# EAGLE board Baboi_v1.1 (EAGLE 6.4)
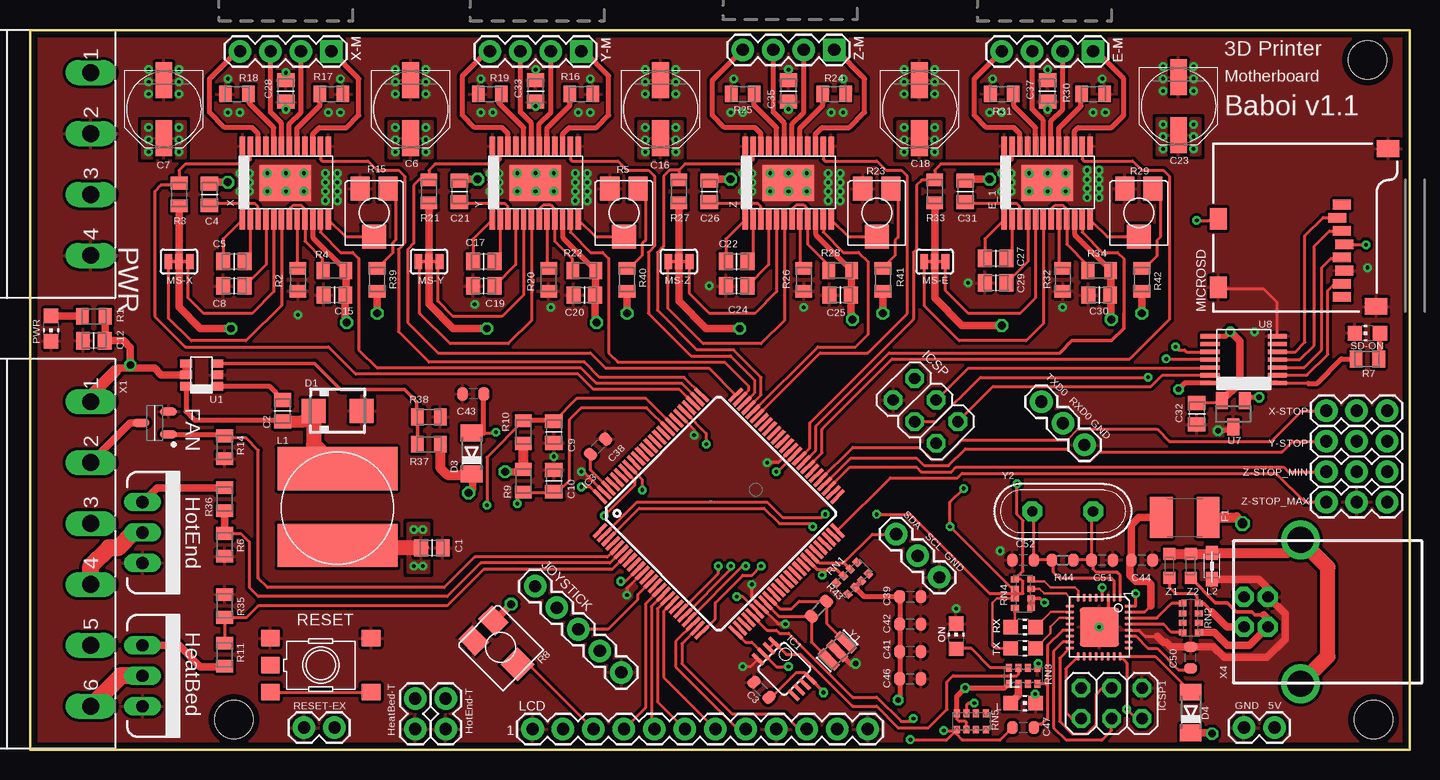
[diagram p2: board, top side]
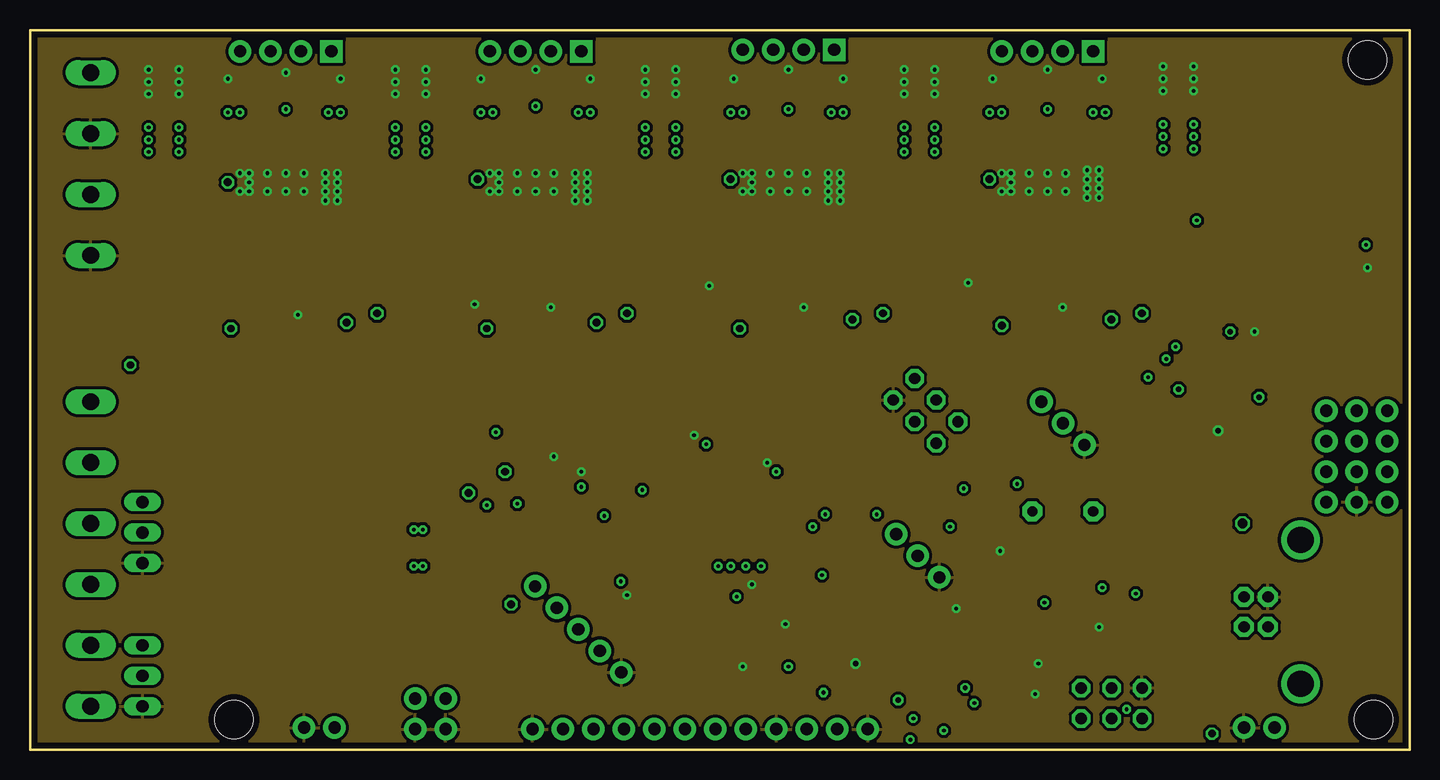
[diagram p3: board, inner layer GND]
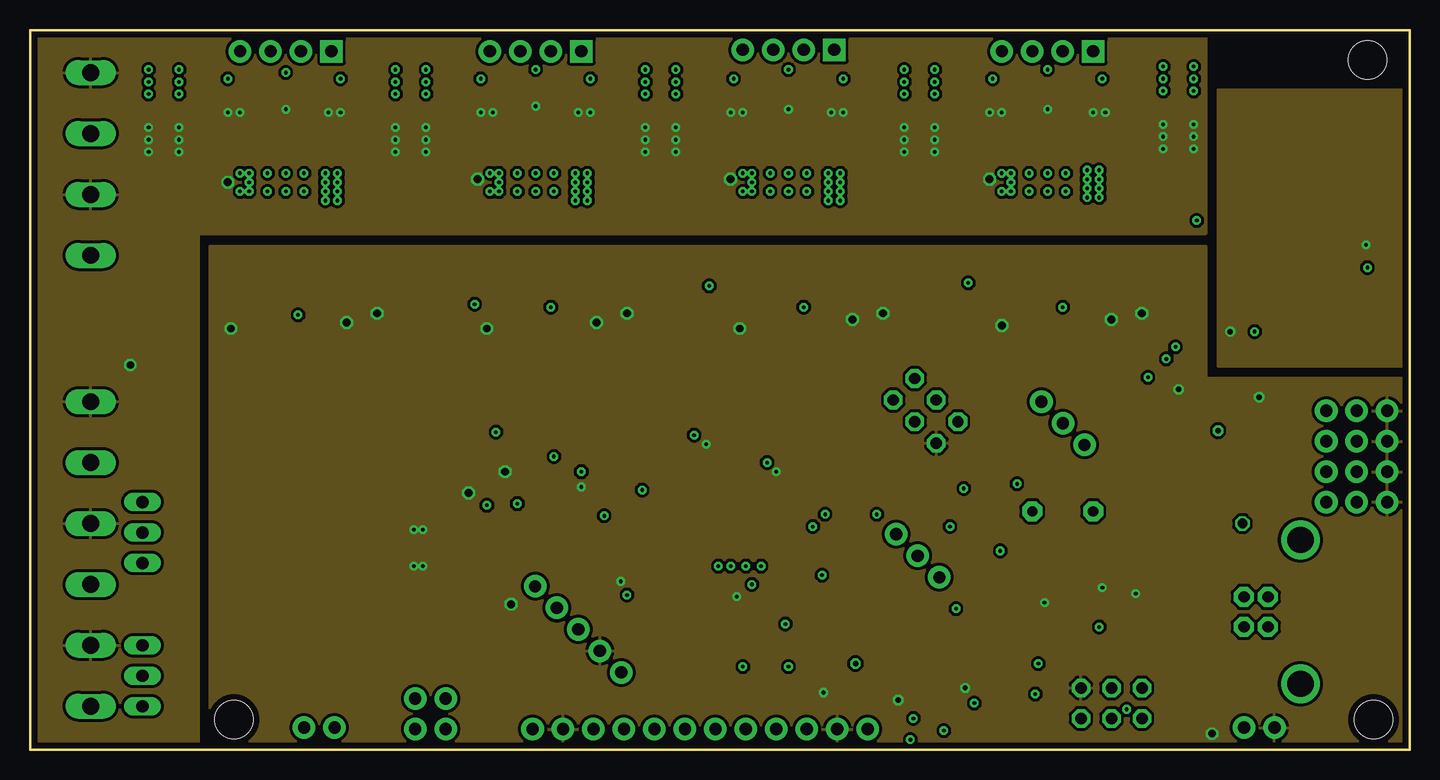
[diagram p4: board, inner layer PWR]
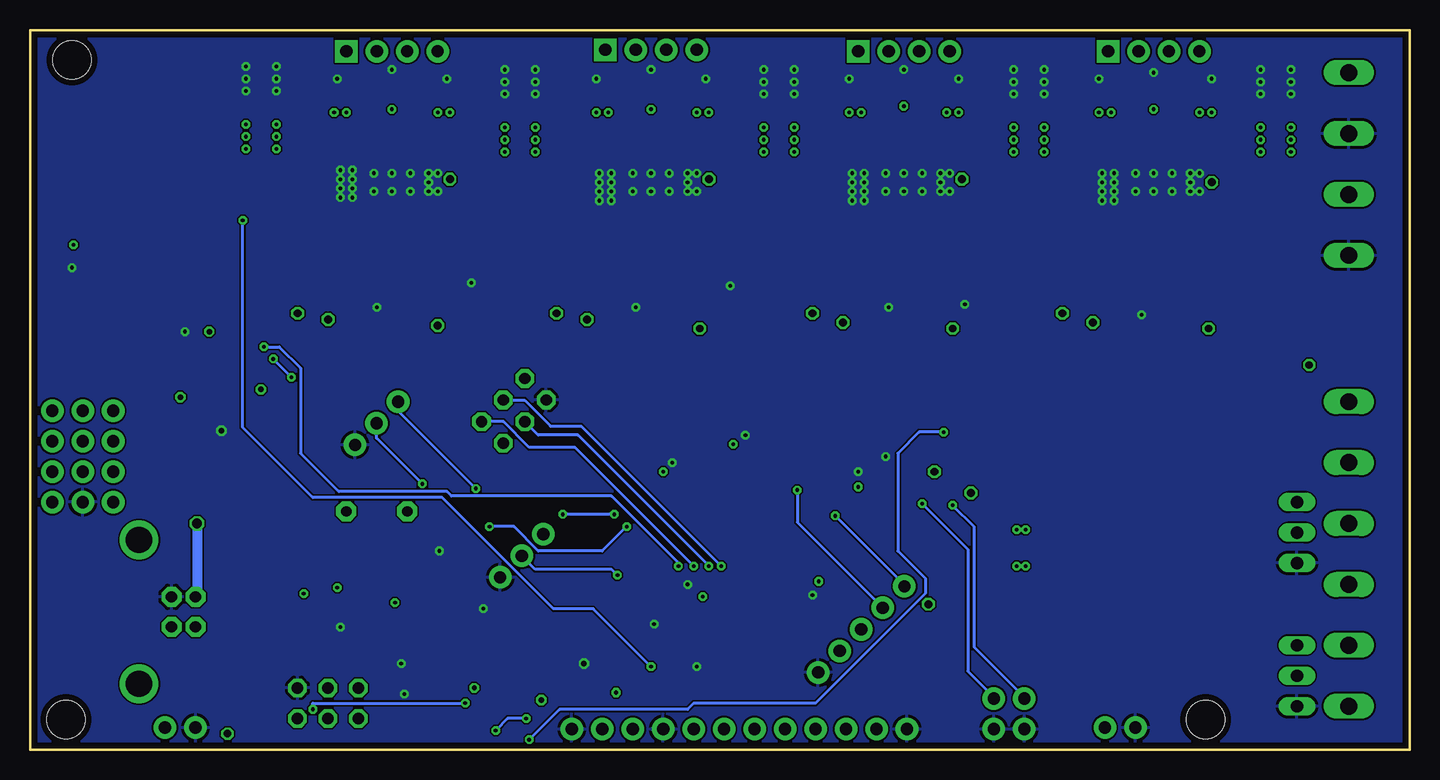
[diagram p5: board, bottom side, seen from below]

Size 115 x 60 mm. Coordinates in mm from the lower left corner, seen from the top.
Outline: 0,0 115,0 115,60 0,60 0,0
Copper layers (1*2+3*16): Top 0.035mm / dielectric 0.6mm / GND 0.035mm / dielectric 0.2mm / PWR 0.035mm / dielectric 0.6mm / Bottom 0.035mm
Design rules "default": minimum track width 6mil, minimum drill 12mil, track to track 6mil, track to pad 7mil, pad to pad 6mil, via to via 6mil, smd to smd 0mil, copper to edge 20mil, drill to drill 10mil, minimum pad ring 10mil, minimum via ring 8mil, stop-mask expansion 6mil, vias tented up to drill 100mil, thermal gap 10mil
Net classes: 2 gnd: width 0.305 mm, drill 0.406 mm, clearance 0.203 mm; 3 power usb: width 0.508 mm, drill 0.406 mm, clearance 0.203 mm
Holes 3.2 mm at 112,2.5 111.5,57.5 17,2.5

## Footprints (pad centres in the part's own frame; a part is rotated, then mirrored left to right if it is on the bottom)
1X02 = drill 1.016 pad 1.88: 1 0,0; 2 2.54,0
CAPC2012X145AN = smd 1.15 x 1.45: 1 -0.9,0; 2 0.9,0
SMARTPRJ_C0603-ROUND = smd 0.898 x 1.1: 1 -0.889,0; 2 0.889,0
PANASONIC_D = smd 3 x 1.4: + 2.4,0; - -2.4,0
C0603-ROUND = smd 0.898 x 1.1: 1 -0.889,0; 2 0.889,0
SMA = smd 2 x 2: A 2,0; C -2,0
MINIMELF = smd 1.4 x 1.8: A 1.7,0; C -1.7,0
1X04 = drill 1.016 pad 1.88 square: 1 0,0 | drill 1.016 pad 1.88: 2 2.54,0; 3 5.08,0; 4 7.62,0
TSSOP-24 = smd 0.45 x 1.65: 1 -3.6,-3.1; 2 -2.95,-3.1; 3 -2.3,-3.1; 4 -1.65,-3.1; 5 -1,-3.1; 6 -0.35,-3.1; 7 0.3,-3.1; 8 0.95,-3.1; 9 1.6,-3.1; 10 2.25,-3.1; 11 2.9,-3.1; 12 3.55,-3.1; 13 3.55,3; 14 2.9,3; 15 2.25,3; 16 1.6,3; 17 0.95,3; 18 0.3,3; 19 -0.35,3; 20 -1,3; 21 -1.65,3; 22 -2.3,3; 23 -2.95,3; 24 -3.6,3 | smd 4.32 x 3: PAD -0.025,-0.05
L1812 = smd 1.9 x 3.4: 1 -1.95,0; 2 1.95,0
SOT95P280X135-3N = smd 1.4 x 0.65: 1 -1.15,0.95; 2 -1.15,-0.95; 3 1.15,0
TO220V = drill 1.016 long: 1 -2.54,0; 2 0,0; 3 2.54,0
LINEAR_MSOP08 = smd 0.3 x 1.2: 1 -0.976,-2.113; 2 -0.326,-2.113; 3 0.324,-2.113; 4 0.974,-2.113; 5 0.974,2.112; 6 0.324,2.112; 7 -0.326,2.112; 8 -0.976,2.112
TQFP100 = smd 1.5 x 0.3: 1 -8,6; 2 -8,5.5; 3 -8,5; 4 -8,4.5; 5 -8,4; 6 -8,3.5; 7 -8,3; 8 -8,2.5; 9 -8,2; 10 -8,1.5; 11 -8,1; 12 -8,0.5; 13 -8,0; 14 -8,-0.5; 15 -8,-1; 16 -8,-1.5; 17 -8,-2; 18 -8,-2.5; 19 -8,-3; 20 -8,-3.5; 21 -8,-4; 22 -8,-4.5; 23 -8,-5; 24 -8,-5.5; 25 -8,-6; 51 8,-6; 52 8,-5.5; 53 8,-5; 54 8,-4.5; 55 8,-4; 56 8,-3.5; 57 8,-3; 58 8,-2.5; 59 8,-2; 60 8,-1.5; 61 8,-1; 62 8,-0.5; 63 8,0; 64 8,0.5; 65 8,1; 66 8,1.5; 67 8,2; 68 8,2.5; 69 8,3; 70 8,3.5; 71 8,4; 72 8,4.5; 73 8,5; 74 8,5.5; 75 8,6 | smd 0.3 x 1.5: 26 -6,-8; 27 -5.5,-8; 28 -5,-8; 29 -4.5,-8; 30 -4,-8; 31 -3.5,-8; 32 -3,-8; 33 -2.5,-8; 34 -2,-8; 35 -1.5,-8; 36 -1,-8; 37 -0.5,-8; 38 0,-8; 39 0.5,-8; 40 1,-8; 41 1.5,-8; 42 2,-8; 43 2.5,-8; 44 3,-8; 45 3.5,-8; 46 4,-8; 47 4.5,-8; 48 5,-8; 49 5.5,-8; 50 6,-8; 76 6,8; 77 5.5,8; 78 5,8; 79 4.5,8; 80 4,8; 81 3.5,8; 82 3,8; 83 2.5,8; 84 2,8; 85 1.5,8; 86 1,8; 87 0.5,8; 88 0,8; 89 -0.5,8; 90 -1,8; 91 -1.5,8; 92 -2,8; 93 -2.5,8; 94 -3,8; 95 -3.5,8; 96 -4,8; 97 -4.5,8; 98 -5,8; 99 -5.5,8; 100 -6,8
MLF32 = smd 0.7 x 0.28: 1 -2.45,1.75; 2 -2.45,1.25; 3 -2.45,0.75; 4 -2.45,0.25; 5 -2.45,-0.25; 6 -2.45,-0.75; 7 -2.45,-1.25; 8 -2.45,-1.75; 17 2.45,-1.75; 18 2.45,-1.25; 19 2.45,-0.75; 20 2.45,-0.25; 21 2.45,0.25; 22 2.45,0.75; 23 2.45,1.25; 24 2.45,1.75 | smd 0.28 x 0.7: 9 -1.75,-2.45; 10 -1.25,-2.45; 11 -0.75,-2.45; 12 -0.25,-2.45; 13 0.25,-2.45; 14 0.75,-2.45; 15 1.25,-2.45; 16 1.75,-2.45; 25 1.75,2.45; 26 1.25,2.45; 27 0.75,2.45; 28 0.25,2.45; 29 -0.25,2.45; 30 -0.75,2.45; 31 -1.25,2.45; 32 -1.75,2.45 | smd 3.254 x 3.254: 33 0,0
2X03 = drill 0.95 pad 1.55 octagon: 1 -2.54,-1.27; 2 -2.54,1.27; 3 0,-1.27; 4 0,1.27; 5 2.54,-1.27; 6 2.54,1.27
1X05 = drill 1.016 pad 1.88: 1 0,0; 2 2.54,0; 3 5.08,0; 4 7.62,0; 5 10.16,0
CHIP-LED0805 = smd 1.2 x 1.2: A 0,-1.05; C 0,1.05
SDR1006 = smd 10.008 x 3.607: P$1 0,3.048; P$2 0,-3.353
0805 = smd 1.2 x 1: 1 -1.1,0; 2 1.1,0
1X12 = drill 1.016 pad 1.88: 1 0,0; 2 2.54,0; 3 5.08,0; 4 7.62,0; 5 10.16,0; 6 12.7,0; 7 15.24,0; 8 17.78,0; 9 20.32,0; 10 22.86,0; 11 25.4,0; 12 27.94,0
SJ_3_CONNECTED = smd 0.635 x 1.27: 1 -0.889,0; 2 0,0; 3 0.889,0
MSTBA4 = drill 1.397 long: 1 -7.62,5.08; 2 -2.54,5.08; 3 2.54,5.08; 4 7.62,5.08
RESC2012X70N = smd 1.05 x 1.4: 1 -0.95,0; 2 0.95,0
RTRIM-ST4ETB = smd 1.6 x 2: 1 -1.175,-2; 2 1.175,-2 | smd 2 x 2: W 0,2
R0603-ROUND = smd 0.898 x 1.1: 1 -0.889,0; 2 0.889,0
TS42 = smd 1.6 x 1.4: 1 -4.2,2.25; 2 4.2,2.25; 3 -4.2,-2.25; 4 4.2,-2.25; 5 -4.2,0
RESISTOR-DIL_CAT16 = smd 0.5 x 0.65: 1 -1.2,-0.675; 2 -0.4,-0.675; 3 0.4,-0.675; 4 1.2,-0.675; 5 1.2,0.675; 6 0.4,0.675; 7 -0.4,0.675; 8 -1.2,0.675
CAY16 = smd 0.5 x 0.65: 1 -1.2,-0.675; 2 -0.4,-0.675; 3 0.4,-0.675; 4 1.2,-0.675; 5 1.2,0.675; 6 0.4,0.675; 7 -0.4,0.675; 8 -1.2,0.675
CAT16 = smd 0.5 x 0.65: 1 -1.2,-0.675; 2 -0.4,-0.675; 3 0.4,-0.675; 4 1.2,-0.675; 5 1.2,0.675; 6 0.4,0.675; 7 -0.4,0.675; 8 -1.2,0.675
1X03 = drill 1.016 pad 1.88: 1 0,0; 2 2.54,0; 3 5.08,0
TSOT6 = smd 0.69 x 1: 1 -1,-1.4; 2 -0.05,-1.4; 3 0.9,-1.4; 4 0.9,1.2; 5 -0.05,1.2; 6 -1,1.2
MICRO-SD-SOCKET-PP = smd 0.8 x 1.5: 1 -8.94,10.7; 2 -7.84,10.3; 3 -6.74,10.7; 4 -5.64,10.9; 5 -4.54,10.7; 6 -3.44,10.9; 7 -2.34,10.7; 8 -1.24,10.7 | smd 1.8 x 1.4: CD1 -2.05,0.4; CD2 -7.75,0.4 | smd 1.4 x 1.9: GND1 -13.6,14.55; GND3 -0.45,13.55
SOT23C = smd 1 x 1.4: 1 -0.95,-1.1; 2 0.95,-1.1; 3 0,1.1
TSSOP14 = smd 0.35 x 1.6: 1 -2,-2.9; 2 -1.35,-2.9; 3 -0.7,-2.9; 4 -0.05,-2.9; 5 0.6,-2.9; 6 1.25,-2.9; 7 1.9,-2.9; 8 1.9,2.7; 9 1.25,2.7; 10 0.6,2.7; 11 -0.05,2.7; 12 -0.7,2.7; 13 -1.35,2.7; 14 -2,2.7
MSTBA6 = drill 1.397 long: 1 -12.7,5.08; 2 -7.62,5.08; 3 -2.54,5.08; 4 2.54,5.08; 5 7.62,5.08; 6 12.7,5.08
PN61729 = drill 0.95 pad 1.676 octagon: 1 1.25,4.71; 2 -1.25,4.71; 3 -1.25,2.71; 4 1.25,2.71 | drill 2.2: P$1 -6,0; P$2 6,0
RESONATOR = smd 0.7 x 2: 1 -1,0; 2 0,0; 3 1,0
QS = drill 0.85 pad 1.676 octagon: 1 -2.54,0; 2 2.54,0
CT/CN0603 = smd 1 x 1: 1 -1,0; 2 1,0

## Placement (x,y rotation side)
5V  [1X02]  101.2,1.83 0 top
B-T  [1X02]  34.66,1.7 90 top
C1  22uF  [CAPC2012X145AN]  33.51,16.82 0 top
C2  0.22uF  [CAPC2012X145AN]  21.07,28.25 90 top
C3  100n  [SMARTPRJ_C0603-ROUND]  60.97,4.99 135 top
C4  0.1uF  [CAPC2012X145AN]  14.97,46.28 270 top
C5  0.1uF  [CAPC2012X145AN]  17,40.69 180 top
C6  100uF  [PANASONIC_D]  31.73,53.39 270 top
C7  100uF  [PANASONIC_D]  11.16,53.39 270 top
C8  0.22uF  [CAPC2012X145AN]  17,38.66 0 top
C9  10uF  [CAPC2012X145AN]  43.67,26.47 90 top
C10  10uF  [CAPC2012X145AN]  43.67,22.4 270 top
C12  1uF  [CAPC2012X145AN]  5.32,34.09 180 top
C15  10uF  [CAPC2012X145AN]  25.38,37.9 0 top
C16  100uF  [PANASONIC_D]  52.56,53.39 270 top
C17  0.1uF  [CAPC2012X145AN]  37.83,40.69 180 top
C18  100uF  [PANASONIC_D]  74.15,53.39 270 top
C19  0.22uF  [CAPC2012X145AN]  37.83,38.66 0 top
C20  10uF  [CAPC2012X145AN]  46.21,37.9 0 top
C21  0.1uF  [CAPC2012X145AN]  35.8,46.53 270 top
C22  0.1uF  [CAPC2012X145AN]  58.91,40.69 180 top
C23  100uF  [PANASONIC_D]  95.74,53.65 270 top
C24  0.22uF  [CAPC2012X145AN]  58.91,38.66 0 top
C25  10uF  [CAPC2012X145AN]  67.55,37.9 0 top
C26  0.1uF  [CAPC2012X145AN]  56.63,46.53 270 top
C27  0.1uF  [CAPC2012X145AN]  80.5,40.95 180 top
C28  0.1uF  [CAPC2012X145AN]  21.32,54.92 90 top
C29  0.22uF  [CAPC2012X145AN]  80.5,38.91 0 top
C30  10uF  [CAPC2012X145AN]  89.14,37.9 0 top
C31  0.1uF  [CAPC2012X145AN]  77.96,46.53 270 top
C32  10uF  [CAPC2012X145AN]  97.27,27.99 270 top
C33  0.1uF  [CAPC2012X145AN]  42.15,54.92 90 top
C35  0.1uF  [CAPC2012X145AN]  63.23,54.92 90 top
C37  0.1uF  [CAPC2012X145AN]  84.82,54.92 90 top
C38  100n  [C0603-ROUND]  47.36,25.26 45 top
C39  100n  [C0603-ROUND]  73.39,12.75 0 top
C41  100n  [C0603-ROUND]  73.39,8.18 0 top
C42  100n  [C0603-ROUND]  73.39,10.47 0 top
C43  22p  [C0603-ROUND]  36.94,29.64 180 top
C44  100n  [C0603-ROUND]  92.69,15.8 0 top
C46  100n  [C0603-ROUND]  73.39,5.89 0 top
C47  100n  [C0603-ROUND]  82.79,1.83 180 top
C50  1u  [C0603-ROUND]  96.76,7.67 90 top
C51  22p  [C0603-ROUND]  89.39,15.8 0 top
C52  22p  [C0603-ROUND]  82.79,15.8 180 top
D1  [SMA]  25.64,28.25 0 top
D3  CD1206-S01575  [MINIMELF]  36.81,24.69 90 top
D4  CD1206-S01575  [MINIMELF]  96.76,3.1 90 top
E-M  [1X04]  88.63,58.22 180 top
E_1  A4982  [TSSOP-24]  84.82,47.3 0 top
F1  MF-MSMF050-2 500mA  [L1812]  96.25,19.36 0 top
FAN  RFP30N06LE  [SOT95P280X135-3N]  10.4,27.23 180 top
HEATBED  RFP30N06LE  [TO220V]  9.38,6.15 270 top
HOT-T  [1X02]  32.11,1.7 90 top
HOTEND  RFP30N06LE  [TO220V]  9.38,18.09 270 top
IC1  LINEAR_LMV358MMX  [LINEAR_MSOP08]  62.87,6.72 225 top
IC3  ATMEGA2560-16AU  [TQFP100]  57.42,19.67 45 top
IC4  ATMEGA16U2-MU  [MLF32]  89.14,10.21 270 top
ICSP  3x2M  [2X03]  74.66,28.25 135 top
ICSP1  3x2M  [2X03]  90.15,3.86 0 top
JOYSTICK  [1X05]  49.3,6.43 135 top
L  YELLOW  [CHIP-LED0805]  82.79,3.86 270 top
L1  47uH  [SDR1006]  25.64,20.37 0 top
L2  BLM21  [0805]  98.54,15.29 90 top
LCD  M12PTH  [1X12]  69.83,1.7 180 top
LED  PWR  [CHIP-LED0805]  1.76,35.1 180 top
MS-E  [SJ_3_CONNECTED]  75.42,40.69 180 top
MS-X  [SJ_3_CONNECTED]  12.43,40.69 180 top
MS-Y  [SJ_3_CONNECTED]  33.26,40.69 180 top
MS-Z  [SJ_3_CONNECTED]  54.09,40.69 180 top
ON  GREEN  [CHIP-LED0805]  77.2,9.45 0 top
PWR  MSTBA4  [MSTBA4]  -0.02,48.82 270 top
R1  3k  [RESC2012X70N]  5.32,36.12 0 top
R2  10k  [RESC2012X70N]  22.34,39.17 270 top
R3  100k  [RESC2012X70N]  12.43,46.28 90 top
R4  100k  [RESC2012X70N]  25.38,39.93 180 top
R5  10k  [RTRIM-ST4ETB]  49.51,44.76 180 top
R6  100k  [RESC2012X70N]  16.24,17.07 270 top
R7  750  [RESC2012X70N]  111.49,32.56 180 top
R8  10k  [RTRIM-ST4ETB]  39.23,8.51 225 top
R9  4.7k  [RESC2012X70N]  41.13,22.4 90 top
R10  4.7k  [RESC2012X70N]  41.13,26.47 270 top
R11  100  [RESC2012X70N]  16.24,7.91 270 top
R14  100k  [RESC2012X70N]  16.24,25.2 270 top
R15  10k  [RTRIM-ST4ETB]  28.69,44.76 180 top
R16  0.1  [RESC2012X70N]  45.96,54.66 0 top
R17  0.11  [RESC2012X70N]  25.13,54.66 0 top
R18  0.11  [RESC2012X70N]  17.26,54.66 180 top
R19  0.1  [RESC2012X70N]  38.34,54.66 180 top
R20  10k  [RESC2012X70N]  43.24,39.17 270 top
R21  100k  [RESC2012X70N]  33.26,46.53 90 top
R22  100k  [RESC2012X70N]  46.21,39.93 180 top
R23  10k  [RTRIM-ST4ETB]  70.6,44.76 180 top
R24  0.1  [RESC2012X70N]  67.04,54.66 0 top
R25  0.1  [RESC2012X70N]  59.42,54.66 180 top
R26  10k  [RESC2012X70N]  64.5,39.17 270 top
R27  100k  [RESC2012X70N]  54.09,46.53 90 top
R28  100k  [RESC2012X70N]  67.55,39.93 180 top
R29  10k  [RTRIM-ST4ETB]  92.44,44.76 180 top
R30  0.1  [RESC2012X70N]  88.63,54.66 0 top
R31  0.1  [RESC2012X70N]  81.01,54.66 180 top
R32  10k  [RESC2012X70N]  86.09,39.17 270 top
R33  100k  [RESC2012X70N]  75.42,46.53 90 top
R34  100k  [RESC2012X70N]  89.14,39.93 180 top
R35  100k  [RESC2012X70N]  16.24,11.97 90 top
R36  100  [RESC2012X70N]  16.24,20.88 90 top
R37  5.6k  [RESC2012X70N]  33.26,25.45 180 top
R38  1k  [RESC2012X70N]  33.26,27.74 0 top
R39  20k  [RESC2012X70N]  28.94,39.17 270 top
R40  20k  [RESC2012X70N]  49.77,39.17 270 top
R41  20k  [RESC2012X70N]  71.1,39.17 270 top
R42  20k  [RESC2012X70N]  92.69,39.17 270 top
R43  1M  [R0603-ROUND]  65.77,11.74 225 top
R44  1M  [R0603-ROUND]  86.09,15.8 180 top
RESET  TS42031-160R-TR-7260  [TS42]  24.24,7.04 0 top
RESET-EX  [1X02]  22.84,1.83 0 top
RN1  10k  [RESISTOR-DIL_CAT16]  68.56,14.28 225 top
RN2  22R  [CAY16]  96.76,10.97 270 top
RN3  1k  [CAY16]  82.79,6.15 0 top
RN4  1k  [CAY16]  82.79,13.01 270 top
RN5  10K  [CAT16]  78.47,2.34 0 top
RX  YELLOW  [CHIP-LED0805]  82.79,10.21 270 top
RXD-TXD  [1X03]  84.31,29 315 top
SD-ON  Red  [CHIP-LED0805]  111.49,34.72 90 top
SDA-SCL  [1X03]  72.21,17.95 315 top
TX  YELLOW  [CHIP-LED0805]  82.79,8.43 270 top
U1  LM2841  [TSOT6]  14.21,31.29 90 top
U2  USD-SOCKETNEW  [MICRO-SD-SOCKET-PP]  98.66,36.5 270 top
U7  AP7313  [SOT23C]  100.31,27.99 180 top
U8  TXB0104  [TSSOP14]  101.08,32.56 90 top
X  A4982  [TSSOP-24]  21.32,47.3 0 top
X1  MSTBA6  [MSTBA6]  -0.02,16.31 270 top
X4  USB-B_TH  [PN61729]  105.9,11.48 90 top
X-M  [1X04]  25.13,58.22 180 top
X-STOP  [1X03]  113.14,28.25 180 top
Y  A4982  [TSSOP-24]  42.15,47.3 0 top
Y1  CSTCE16M0V53-R0 16MHZ  [RESONATOR]  67.29,8.22 45 top
Y2  16MHz  [QS]  86.09,19.86 0 top
Y-M  [1X04]  45.96,58.22 180 top
Y-STOP  [1X03]  113.14,25.71 180 top
Z  A4982  [TSSOP-24]  63.23,47.3 0 top
Z1  CG0603MLC-05E  [CT/CN0603]  94.98,15.29 270 top
Z2  CG0603MLC-05E  [CT/CN0603]  96.76,15.29 270 top
Z-M  [1X04]  67.04,58.34 180 top
Z-STOP_MAX  [1X03]  113.14,20.63 180 top
Z-STOP_MIN  [1X03]  113.14,23.17 180 top

## Tracks (layer width: path | path; a pad name or v marks a point on that pad's centre or on a via)
12V  (via drill 0.3, 0.61, 0.66)
  Top 0.61: C4.1 15.09,47.3 v16.49,47.3 | 35.91,47.55 v37.32,47.55 | C26.1 56.74,47.55 v58.4,47.55 | C31.1 78.08,47.55 v79.99,47.55 | U1.4 U1.5 10.96,31.24 10.4,31.8 8.37,31.8 | 8.37,31.8 7.35,31.8 7.1,31.55 | 8.37,31.8 v8.37,32.06 8.37,33.53 7.81,34.09 C12.1 6.27,34.14 R1.2
  Top 0.813: C21.1 35.91,47.55
  Top 1.016: X1.1 5.06,29.52 7.1,31.55
  other vias: 16.49,53.14 17.51,53.14 21.32,53.39 24.88,53.14 25.89,53.14 9.89,51.87 9.89,50.85 9.89,49.84 12.43,51.87 12.43,50.85 12.43,49.84 37.58,53.14 38.59,53.14 42.15,53.65 45.7,53.14 46.72,53.14 33,51.87 33,50.85 33,49.84 30.46,49.84 30.46,50.85 30.46,51.87 63.23,53.39 58.4,53.14 59.42,53.14 66.79,53.14 67.8,53.14 53.83,51.87 53.83,50.85 53.83,49.84 51.29,49.84 51.29,50.85 51.29,51.87 79.99,53.14 81.01,53.14 88.63,53.14 89.65,53.14 84.82,53.39 75.42,51.87 75.42,50.85 75.42,49.84 72.88,49.84 72.88,50.85 72.88,51.87 97.01,52.12 97.01,51.11 97.01,50.09 94.47,50.09 94.47,51.11 94.47,52.12
  pour Top: 17.51,50.85 24.88,50.85 27.42,52.88 27.42,53.9 14.97,53.9 14.97,53.14
  pour Top: 9.38,52.38 12.94,52.38 12.94,49.33 9.38,49.33
  pour Top: 38.34,50.85 45.96,50.85 48.24,52.88 48.24,53.9 36.05,53.9 36.05,52.88
  pour Top: 29.96,52.38 33.51,52.38 33.51,49.33 29.96,49.33
  pour Top: 59.42,50.85 66.79,50.85 69.58,52.88 69.58,54.41 56.88,54.41 56.88,53.14
  pour Top: 50.78,52.38 54.34,52.38 54.34,49.33 50.78,49.33
  pour Top: 81.01,50.85 88.38,50.85 91.17,52.88 91.17,54.15 78.72,54.15 78.72,52.88
  pour Top: 72.37,52.38 75.93,52.38 75.93,49.33 72.37,49.33
  pour Top: 93.96,52.63 97.52,52.63 97.52,49.58 93.96,49.58
  pour PWR (isolate 0.254, rank 6): 0,60 98,60 98,43 14,43 14,0 0,0
+3V3  (via drill 0.3, 0.46)
  Top 0.254: U2.4 109.61,42.09 v111.36,42.09 | U8.1 106.5,30.56 106.54,30.53 | U7.2 99.16,28.89 C32.1
  Top 0.406: U8.1 100.85,30.56 100.82,30.53 | U8.8 99.67,34.46 v100.06,34.85 | 106.54,30.53 107.3,30.53 109.33,32.56 R7.2
  Top 0.61: 100.85,30.56 100.85,34.06 v100.06,34.85 | U7.2 100.8,30.53 100.82,30.53
  pour PWR (isolate 0.254): 99,32 115,32 115,55 99,55
+5V  (via drill 0.3, 0.36, 0.41, 0.46, 0.61, 0.66)
  Top 0.254: IC4.4 v89.39,13.51 | IC4.32 92.19,11.96 v92.19,13.01 | RN5.8 77.27,2.52 77.45,2.34 77.96,2.34 78.07,2.23 RN5.2 | IC3.100 46.71,21.9 v45.96,21.9 | IC3.80 56.37,26.37 v56.37,25.45 | IC3.61 62.33,23.17 v62.21,23.17 | IC3.31 59.39,12.75 v58.91,12.75 | IC3.10 49.65,14.02 v49.26,14.02 | IC1.8 64.57,6.4 63.87,6.4 61.83,4.36 C3.1
  Top 0.305: RN4.6 84.2,12.61 v84.57,12.24 | IC1.8 arc-3 v66.15,4.75
  Top 0.406: X.10 23.57,42.69 R4.1 | Y.10 44.4,42.69 R22.1 | Z.10 65.48,42.95 R28.1 | E_1.10 87.07,42.95 R34.1 | U8.14 96.28,30.56 v95.74,30.02 | RN5.8 77.27,4.44 v77.96,5.13 81.25,5.13 RN3.1 | v72.37,4.12 72.5,4.24 C46.1 C41.1 C42.1 C39.1 69.52,12.75 RN1.6 RN1.7 | U7.1 101.56,29.39 v102.47,29.39
  Top 0.61: MS-X.2 R3.1 12.43,36.88 14.21,35.1 v16.75,35.1 | v26.4,35.61 26.28,35.73 C15.2 26.33,37.95 R4.1 | R22.1 47.16,37.95 C20.2 47.11,35.73 v47.23,35.61 | R21.1 MS-Y.2 33.26,37.14 35.29,35.1 v38.08,35.1 | R39.2 v28.94,36.37 | R40.2 v49.77,36.37 | R27.1 MS-Z.2 54.09,37.39 56.37,35.1 v59.17,35.1 | R28.1 68.5,37.9 C25.2 68.45,35.87 v68.56,35.87 | R41.2 v71.1,36.37 | R34.1 90.09,37.95 | 90.09,37.95 C30.2 | R33.1 MS-E.2 75.42,37.64 77.71,35.36 v81.01,35.36 | 90.09,37.95 90.09,36.12 | R42.2 v92.69,36.37 | RN4.6 RN4.5 | 36.89,22.91 36.89,21.72 v36.56,21.39 | R9.2 40.94,23.17 v39.61,23.17 | D4.C 98.54,1.4 v98.54,1.32 | 38.72,10.83 38.83,10.83 v40.12,12.12
  Top 0.813: 90.09,36.12 90.09,35.93 v90.15,35.87 | 36.89,22.91 D3.C 36.74,22.91 34.78,22.91 34.21,23.49 R37.1 | R9.2 R10.2 | R8.1 38.72,10.83
  Top 1.27: C1.1 29.19,16.82 29.19,17.07 25.64,17.07 L1.P$2
  other vias: 31.99,18.34 32.75,18.34 31.99,15.29 32.75,15.29
  pour PWR (isolate 0.254): 15,42 98,42 98,31 115,31 115,0 15,0
  pour Top (isolate 0.254): 31.48,18.85 31.48,14.78 33.26,14.78 33.26,18.85
A3  (via drill 0.3)
  Top 0.254: IC3.94 50.4,22.44 50.4,22.02 v47.86,19.48
  Bottom 0.254: v47.86,19.48 42.11,13.73 JOYSTICK.5
A4  (via drill 0.3)
  Top 0.254: IC3.93 51.04,22.51 v51.04,21.64
  Bottom 0.254: v51.04,21.64 51.04,18.95 JOYSTICK.4
A13  (via drill 0.3)
  Top 0.254: IC3.84 51.42,28.5 45.96,28.5 44.94,27.48 44.94,22.4 44.43,21.9 44.06,21.9 C10.2 43.62,21.45 R9.1 40.62,20.95 v40.62,20.5
  Bottom 0.254: v40.62,20.5 36.81,16.69 36.81,6.53 34.66,4.37 B-T.2
A14  (via drill 0.3)
  Top 0.254: IC3.83 51.36,29.26 45.57,29.26 C9.2 | R10.1 38.08,24.37 v38.08,20.37
  Top 0.406: C9.2 43.62,27.42 R10.1
  Bottom 0.254: v38.08,20.37 36.31,18.59 36.31,8.56 32.11,4.37 HOT-T.2
AREF
  Top 0.254: IC3.98 46.72,23.3 C38.1 | C38.1 | C38.1 46.72,24.69
D2
  Top 0.254: IC3.6 48.34,15.55 37.58,15.55 34.78,12.75 19.03,12.75 18.27,13.51 18.27,17.32 17.58,18.02 R6.1
  Top 0.61: R36.1 R6.1
D3
  Top 0.254: R11.1 R35.1 18.07,11.02 19.03,11.99 34.78,11.99 37.83,15.04 48.54,15.04 IC3.7
D5
  Top 0.254: IC3.5 48.14,16.05 37.07,16.05 34.53,13.51 19.8,13.51 19.03,14.28 19.03,24.94 18.02,25.96 16.43,25.96 R14.1
  Top 0.406: FAN.1 16.24,26.28 R14.1
D6
  Top 0.254: IC3.15 51.29,12.13 51.29,3.48 LCD.9
D7
  Top 0.254: IC3.16 51.8,11.93 51.8,1.96 LCD.8
D8
  Top 0.254: IC3.17 52.31,11.73 52.31,3.99 LCD.7
D9
  Top 0.254: IC3.18 52.82,11.54 52.82,6.02 LCD.6
D10
  Top 0.254: IC3.23 53.83,9.02 53.83,6.91 59.04,1.7 LCD.5
D11
  Top 0.254: IC3.24 54.34,8.82 54.34,7.16 58.53,2.97 62.85,2.97 64.12,1.7 LCD.3
D12  (via drill 0.3)
  Top 0.254: IC3.25 57.13,10.9 57.13,12.24 59.42,14.53 60.18,14.53 v60.94,15.29 | v95.49,33.58 95.74,33.33 96.25,33.33 96.41,33.16 U8.10
  Bottom 0.254: v60.94,15.29 60.94,15.55 66.53,21.13 79.87,21.13 80.25,21.52 89.27,21.52 92.44,24.69 92.44,31.8 94.22,33.58 v95.49,33.58
D13  (via drill 0.3)
  Top 0.254: v63.23,6.91 62.21,6.91 IC1.3 60.18,8.94 59.66,8.94 IC3.26 | v97.27,44.12 98.93,44.12 U2.CD2
  Bottom 0.254: v63.23,6.91 68.06,11.74 71.36,11.74 80.63,21.01 91.42,21.01 97.27,26.85 v97.27,44.12
D16
  Top 0.254: IC3.13 50.66,12.91 50.66,12.5 48.18,10.02 JOYSTICK.3
D22
  Top 0.254: X.23 18.37,49.17 18.02,48.82 12.94,48.82 12.43,48.31 R3.2 12.43,47.04 10.91,47.04 10.4,46.53 10.4,36.12 12.94,33.58 24.88,33.58 27.16,31.29 45.7,31.29 46.97,30.02 54.13,30.02 IC3.78
D23
  Top 0.254: X.11 24.22,43.13 25.89,41.45 26.91,41.45 27.42,40.95 27.42,33.33 28.94,31.8 45.96,31.8 47.23,30.53 54.33,30.53 IC3.77
D24
  Top 0.254: X.14 24.22,49.22 24.37,49.07 28.18,49.07 28.94,48.31 30.72,48.31 31.23,47.8 31.23,42.22 30.72,41.71 30.72,34.85 33,32.56 33.26,32.31 46.21,32.31 47.48,31.04 54.53,31.04 IC3.76
D25
  Top 0.254: Y.23 39.2,49.17 38.85,48.82 33.77,48.82 33.26,48.31 R21.2 33.26,47.3 33,47.55 32.5,47.55 31.99,47.04 31.99,42.22 31.48,41.71 31.48,35.61 34.02,33.07 46.72,33.07 47.99,31.8 56.6,31.8 IC3.75
D26
  Top 0.254: Y.11 45.05,43.13 46.72,41.45 47.74,41.45 48.24,40.95 48.24,33.07 49.01,32.31 57.9,32.31 59.93,30.28 59.93,29.96 IC3.74
D27
  Top 0.254: Y.14 45.05,49.22 45.2,49.07 49.01,49.07 49.77,48.31 51.55,48.31 52.05,47.8 52.05,41.96 51.55,41.45 51.55,36.37 55.1,32.82 58.4,32.82 60.44,30.79 60.44,29.76 IC3.73
D28
  Top 0.254: Z.23 60.28,49.17 59.93,48.82 54.59,48.82 54.09,48.31 | 54.09,48.31 R27.2 | 54.09,48.31 53.32,48.31 52.82,47.8 52.82,41.96 52.31,41.45 52.31,36.63 55.61,33.33 58.66,33.33 60.94,31.04 60.94,29.56 IC3.72
D29
  Top 0.254: Z.11 66.13,43.13 67.8,41.45 69.07,41.45 69.83,40.69 69.83,34.6 68.82,33.58 65.67,33.58 IC3.71
D30
  Top 0.254: E_1.23 81.87,49.17 81.52,48.82 75.93,48.82 75.42,48.31 R33.2 74.34,47.48 73.9,47.04 73.9,41.71 73.64,41.45 73.64,35.87 65.01,27.23 65.01,25.14 IC3.60
D31
  Top 0.254: 91.17,36.37 91.17,40.95 90.66,41.45 89.39,41.45 87.72,43.13 E_1.11 | IC3.59 65.52,24.94 65.52,26.98 71.61,33.07 85.84,33.07
  Top 0.305: 91.17,36.37 91.17,35.1 90.15,34.09 86.85,34.09 85.84,33.07
D32
  Top 0.254: E_1.14 87.72,49.22 87.87,49.07 91.93,49.07 92.69,48.31 94.47,48.31 94.98,47.8 94.98,35.87 91.68,32.56 71.87,32.56 66.02,26.72 66.02,24.74 IC3.58
D35
  Top 0.203: 86.47,25.83 87.36,26.72
  Top 0.254: IC3.55 68.6,25.2 74.15,25.2 75.17,24.18 76.06,24.18 77.71,25.83 86.47,25.83 | 87.36,26.72 93.96,26.72 94.98,25.71 103.49,25.71 106.03,28.25 X-STOP.3
D36
  Top 0.254: IC3.54 68.42,24.31 73.9,24.31 74.53,23.67 76.56,23.67 77.96,25.07 86.47,25.07 87.49,24.05 88.38,24.05 89.14,24.82 104.38,24.82 105.27,25.71 Y-STOP.3
D37
  Top 0.254: IC3.53 68.36,23.55 73.9,23.55 74.28,23.17 76.82,23.17 77.2,23.55 104.5,23.55 104.89,23.17 Z-STOP_MIN.3
D38
  Top 0.254: IC3.50 71.72,22.66 77.33,22.66 77.71,23.04 103.87,23.04 106.28,20.63 Z-STOP_MAX.3
D39
  Top 0.254: Z.14 66.13,49.22 66.28,49.07 70.6,49.07 71.36,48.31 72.63,48.31 73.14,47.8 73.14,36.37 69.83,33.07 65.87,33.07 IC3.70
D+
  Top 0.254: 101.84,8.94 101.9,8.94 102.76,9.8 X4.3
  Top 0.305: 102.85,11.23 102.09,11.23 101.84,11.48 100.57,11.48 99.81,12.24 98.81,12.24 Z2.2
  Top 0.61: RN2.5 98.72,9.77 99.81,8.69 101.65,8.69 102.76,9.8 103.11,10.15 103.11,10.97 102.85,11.23
D-
  Top 0.254: Z1.2 94.98,13.51 95.49,13.01 97.01,13.01 97.27,12.75 97.27,12.34 RN2.8
  Top 0.305: RN2.8 97.84,12.17 98.54,11.48
  Top 0.61: 98.54,11.48 99.79,10.23 X4.2
DTR
  Top 0.254: IC4.13 86.09,9.96 84.82,8.69 84.82,5.64 | 84.82,5.64 84.65,5.47 RN3.4 | 84.82,5.64 84.82,2.59 84.31,2.08 83.93,2.08 C47.1
FAN
  Top 0.61: X1.2 8.37,27.23 FAN.3
GND  (via drill 0.3, 0.46)
  Top 0.254: IC4.3 89.89,10.96 IC4.33 | RN3.5 84.06,6.82 v84.06,7.16 | IC3.81 55.36,26.68 v55.36,26.21 | IC3.62 62.38,23.93 v61.45,23.93 | IC3.99 46.14,23.17 v45.96,23.17 | v60.18,13.77 60.18,12.66 IC3.32 62.38,10.47 v62.98,10.47 | IC1.4 60.08,6.91 v59.42,6.91 | U8.7 103.98,37.28 102.85,38.41 99.21,38.41 U2.CD1 | IC3.11 49.77,13.44 v49.77,12.88 | U7.3 100.02,26.59 | IC4.28 92.44,9.96 92.95,9.45 93.96,9.45
  Top 0.406: Y1.2 68.35,7.16 v68.82,7.16 | 100.02,26.59 v99.04,26.59
  Top 0.61: L2.1 102.43,14.19 103.19,13.43 X4.4 104.63,11.29 104.63,9.2 103.11,7.67 99.55,7.67 98.66,8.56 C50.2 95.11,8.56 94.73,8.94 94.47,8.94 93.96,9.45
  Bottom 0.61: 103.19,12.62 X4.4
  other vias: 21.32,48.06 21.32,46.53 19.8,46.53 19.8,48.06 22.84,48.06 22.84,46.53 24.62,48.06 24.62,47.3 24.62,46.53 24.62,45.77 25.64,45.77 25.64,46.53 25.64,47.3 25.64,48.06 18.27,48.06 18.27,47.3 18.27,46.53 42.15,48.06 42.15,46.53 40.62,46.53 40.62,48.06 43.67,48.06 43.67,46.53 45.45,48.06 45.45,47.3 45.45,46.53 45.45,45.77 46.47,45.77 46.47,46.53 46.47,47.3 46.47,48.06 39.1,48.06 39.1,47.3 39.1,46.53 63.23,48.06 63.23,46.53 61.71,46.53 61.71,48.06 64.75,48.06 64.75,46.53 66.53,48.06 66.53,47.3 66.53,46.53 66.53,45.77 67.55,45.77 67.55,46.53 67.55,47.3 67.55,48.06 60.18,48.06 60.18,47.3 60.18,46.53 84.82,48.06 84.82,46.53 83.3,46.53 83.3,48.06 86.34,48.06 86.34,46.53 88.12,48.31 88.12,47.55 88.12,46.79 88.12,46.03 89.14,46.03 89.14,46.79 89.14,47.55 89.14,48.31 81.77,48.06 81.77,47.3 81.77,46.53 9.89,54.66 9.89,55.68 9.89,56.69 12.43,56.69 12.43,55.68 12.43,54.66 33,56.69 33,55.68 33,54.66 30.46,54.66 30.46,55.68 30.46,56.69 53.83,54.66 53.83,55.68 53.83,56.69 51.29,56.69 51.29,55.68 51.29,54.66 72.88,54.66 72.88,55.68 72.88,56.69 75.42,56.69 75.42,55.68 75.42,54.66 94.47,54.92 94.47,55.93 94.47,56.95 97.01,56.95 97.01,55.93 97.01,54.92 102.09,34.85 16.49,55.93 21.32,56.44 42.15,56.69 46.72,55.93 58.66,55.93 63.23,56.69 84.82,56.69 89.39,55.93 25.89,55.93 37.58,55.93 67.8,55.93 80.25,55.93 22.34,36.25 37.07,37.14 43.42,36.88 64.5,36.88 56.63,38.66 78.22,38.91 86.09,36.88 89.14,10.21 83.8,4.62 43.67,24.44 77.2,11.74 111.49,40.18 17.51,48.06 17.51,46.53 38.34,48.06 38.34,46.53 59.42,48.06 59.42,46.53 81.01,48.06 81.01,46.53 80.88,16.56
  pour Top (isolate 0.254, rank 6): 0,60 115,60 115,0 0,0
  pour Bottom (rank 6): 0,60 115,60 115,0 0,0
  pour GND (isolate 0.254): 0,60 115,60 115,0 0,0
HOTBED-GND
  Top 1.422: HEATBED.2 7.6,6.15 X1.6
HOTEND-GND
  Top 1.422: X1.4 5.06,15.29 6.59,16.82 7.35,16.82 8.62,18.09 HOTEND.2
L13
  Top 0.254: RN3.7 82.39,6.26 82.28,6.15 76.95,6.15 76.44,5.64 76.44,3.35 74.91,1.83 72.37,1.83 70.6,3.61 68.56,3.61 64.25,7.93 63.04,7.93 IC1.1 IC1.2
M8RXD
  Top 0.203: IC4.9 86.69,12.66 86.34,13.01 84.57,13.01 84.17,13.41 RN4.7
M8TXD
  Top 0.203: IC4.8 87.39,13.23 87.11,13.51 85.07,13.51 84.57,14.02 83.65,14.02 RN4.8
MISO  (via drill 0.3)
  Top 0.254: IC3.22 59.4,15.29 v59.67,15.29 | ICSP.1 80.28,30.28 93.46,30.28 94.39,31.21 U8.13
  Bottom 0.254: v59.67,15.29 69.58,25.2 73.39,25.2 75.54,27.35 ICSP.1
MISO2
  Top 0.254: IC4.17 86.34,6.72 86.34,3.1 86.85,2.59 ICSP1.1
MOSI  (via drill 0.3)
  Top 0.254: IC3.21 58.4,15 v58.4,15.29 | ICSP.4 75.54,27.35 79.23,31.04 v93.2,31.04 | 98.33,32.56 U8.11 98.38,32.56 v94.73,32.56
  Bottom 0.254: v58.4,15.29 69.33,26.21 72.63,26.21 ICSP.4 | v93.2,31.04 v94.73,32.56
MOSI2
  Top 0.254: IC4.16 85.84,7.61 85.84,2.34 86.85,1.32 88.12,1.32 88.88,2.08 88.88,4.62 89.39,5.13 ICSP1.4
N$1
  Top 0.61: LED.A 4.33,36.15 R1.1
N$2
  Top 0.254: R7.1 112.54,32.66
  Top 0.406: 112.54,32.66 SD-ON.A
N$3
  Top 0.406: X.19 20.97,52.22 20.05,53.14 X-M.3
N$4
  Top 0.406: X.22 19.02,51.37 18.53,51.87 16.24,51.87 14.97,53.14 14.97,55.93 17.26,58.22 X-M.4
N$5
  Top 0.406: Y.19 41.8,52.22 40.88,53.14 Y-M.3
N$6
  Top 0.406: Y.22 39.85,51.37 39.35,51.87 37.07,51.87 36.05,52.88 36.05,56.19 38.08,58.22 Y-M.4
N$7
  Top 0.61: HEATBED.1 12.43,8.69 14.21,6.91 16.19,6.91 R11.2
N$8
  Top 0.254: R5.1 51.29,46.15 51.29,42.47 51.04,42.22 51.04,41.2 49.96,40.12 R40.1
N$9
  Top 0.406: Z.19 62.88,52.22 61.96,53.14 Z-M.3
N$10
  Top 0.406: X.18 21.62,52.17 22.59,53.14 X-M.2
N$11
  Top 0.254: X.1 16.1,42.58 C5.2
N$12
  Top 0.254: X.2 18.37,40.69 C5.1
N$13
  Top 0.254: X.8 22.27,40.18 R2.1
N$14
  Top 0.406: X.17 22.27,51.8 24.18,53.71 R17.1
N$15
  Top 0.406: X.20 20.32,51.85 18.27,53.9 18.27,54.6 R18.1
N$16
  Top 0.254: X.3 19.02,45.28 18.78,45.52 15.11,45.52 C4.2
N$17
  Top 0.406: X.15 23.57,51.32 24.11,51.87 26.4,51.87 27.42,52.88 27.42,55.93 X-M.1
N$18
  Top 0.254: X.12 26.31,42.76 R15.W
N$19
  Top 0.254: X.4 19.67,40.43 C8.2
N$20
  Top 0.406: Z.22 60.93,51.37 60.44,51.87 57.9,51.87 56.88,52.88 56.88,55.81 Z-M.4
N$21
  Top 0.254: R4.2 24.37,40 24.37,40.95 22.92,42.39 X.9 22.92,45.06 22.59,45.39 21.95,45.39 21.62,45.06 X.7
N$22
  Top 0.305: U1.3 23.72,32.19 25.89,30.02 31.23,30.02 32.24,29.01 32.24,27.8 R38.1 R37.2
N$23
  Top 0.406: E_1.19 84.47,52.47 83.55,53.39 E-M.3
N$24
  Top 0.406: E_1.22 82.52,51.37 82.03,51.87 79.74,51.87 78.72,52.88 78.72,55.93 E-M.4
N$26
  Top 0.406: Y.15 44.4,51.32 44.94,51.87 47.23,51.87 48.24,52.88 48.24,56.19 46.21,58.22 Y-M.1
N$27
  Top 0.254: X.5 20.32,38.17 18.53,36.37 14.46,36.37 13.19,37.64 13.19,40.56
  Top 0.406: 13.19,40.56 13.32,40.56 MS-X.1
N$28
  Top 0.254: MS-X.3 11.54,35.99 13.45,34.09 18.02,34.09 20.97,37.04 X.6
N$29
  Top 0.254: Y.1 36.93,42.58 C17.2
N$30
  Top 0.254: Y.2 39.2,40.69 C17.1
N$31
  Top 0.406: Y.18 42.45,52.17 43.42,53.14 Y-M.2
N$32
  Top 0.406: Y.20 41.15,51.85 39.1,53.9 39.1,54.47 R19.1
N$33
  Top 0.254: Y.12 47.14,42.76 R5.W
N$34
  Top 0.254: Y.8 43.1,40.26 R20.1
N$35
  Top 0.254: Y.4 40.5,40.43 C19.2
N$36
  Top 0.254: 45.2,40 45.2,40.95 43.75,42.39 Y.9 43.75,45.06 43.42,45.39 42.78,45.39 42.45,45.06 Y.7
  Top 0.305: 45.2,40 R22.2
N$37
  Top 0.254: Y.3 39.85,45.28 39.61,45.52 35.91,45.52 C21.2
N$38
  Top 0.406: Y.17 43.1,51.8 45.01,53.71 R16.1
N$39
  Top 0.406: Z.15 65.48,51.32 66.02,51.87 68.31,51.87 69.58,53.14 69.58,55.93 67.17,58.34 Z-M.1
N$40
  Top 0.406: Z.18 63.53,52.17 64.5,53.14 Z-M.2
N$42
  Top 0.254: Y.5 41.15,37.91 39.35,36.12 35.29,36.12 34.02,37.39 34.02,40.56 MS-Y.1
N$43
  Top 0.254: Y.6 41.8,35.77 39.86,33.83 35.04,33.83 32.5,36.37 32.5,40.56 MS-Y.3
N$44
  Top 0.254: Z.1 58.01,42.58 C22.2
N$45
  Top 0.254: Z.2 60.28,41.16 C22.1
N$46
  Top 0.406: Z.17 64.18,51.8 66.09,53.71 R24.1
N$47
  Top 0.406: Z.20 62.23,51.85 60.37,53.71 R25.1
N$48
  Top 0.254: Z.12 68.22,42.76 R23.W
N$49
  Top 0.254: Z.8 64.18,40.44 arc90 R26.1
N$50
  Top 0.254: Z.4 61.58,40.43 C24.2
N$51
  Top 0.254: R28.2 66.6,40.37 64.83,42.14 Z.9 64.83,45.06 64.5,45.39 63.87,45.39 63.53,45.06 Z.7
N$52
  Top 0.254: Z.3 60.93,45.28 60.69,45.52 56.74,45.52 C26.2
N$54
  Top 0.406: E_1.15 87.07,51.58 87.36,51.87 90.15,51.87 91.17,52.88 91.17,55.93 88.88,58.22 E-M.1
N$55
  Top 0.406: E_1.18 85.12,52.42 86.09,53.39 E-M.2
N$57
  Top 0.254: Z.5 62.23,38.17 60.44,36.37 56.63,36.37 54.98,38.03 MS-Z.1
N$58
  Top 0.254: Z.6 62.88,35.77 60.94,33.83 56.12,33.83 53.2,36.75 MS-Z.3
N$59
  Top 0.254: E_1.1 79.6,42.58 C27.2
N$60
  Top 0.254: E_1.2 81.87,40.95 C27.1
N$61
  Top 0.406: E_1.17 85.77,51.8 87.61,53.65 87.61,54.6 R30.1
N$62
  Top 0.406: E_1.20 83.82,51.85 82.03,53.65 82.03,54.6 R31.1
N$63
  Top 0.254: E_1.12 89.81,42.76 R29.W
N$64
  Top 0.254: E_1.8 85.77,40.44 R32.1
N$65
  Top 0.254: E_1.4 83.17,40.68 C29.2
N$66
  Top 0.254: R34.2 88.12,40 88.12,40.44 86.42,42.14 E_1.9 86.42,45.06 86.09,45.39 85.45,45.39 85.12,45.06 E_1.7
N$67
  Top 0.254: E_1.3 82.52,45.28 82.28,45.52 78.08,45.52 C31.2
N$68
  Top 0.254: RESET.3 RESET.4
N$69
  Top 0.254: R15.1 30.46,46.15 30.46,42.47 30.21,42.22 30.21,41.39 R39.1
N$70
  Top 0.254: RN3.8 80.08,6.82 78.47,8.43 77.23,8.43 ON.A
N$71
  Top 0.61: HOTEND.1 10.59,21.83 R36.2
N$72
  Top 0.254: E_1.5 83.82,37.66 82.53,36.37 78.22,36.37 76.31,38.28 MS-E.1 76.18,40.56
N$73
  Top 0.254: E_1.6 84.47,35.52 83.04,34.09 77.45,34.09 74.53,37.01 MS-E.3
N$74
  Top 0.254: R29.1 94.22,46.15 94.22,42.72 93.96,42.47 93.96,41.2 92.88,40.12 R42.1
N$75
  Top 0.406: U1.6 13.01,28.18 13.7,27.48 20.93,27.48 C2.1
  Top 1.016: C2.1 22.74,27.35 D1.C
  Top 1.27: D1.C 23.64,25.42 L1.P$1
N$76
  Top 0.203: RN4.4 82.11,10.59 RX.A
N$77
  Top 0.406: U1.1 19.92,30.29 C2.2
N$78
  Top 0.254: R23.1 72.37,46.15 72.37,42.72 72.12,42.47 72.12,41.2 71.1,40.18 R41.1
N$79
  Top 0.203: TX.A 80.5,8.43 80.25,8.69 80.25,12.24 80.61,12.61 RN4.3
N$80
  Top 0.61: RN3.2 82.39,4.51 L.A
N$84  (via drill 0.3)
  Top 0.254: D3.A 38.85,26.39 v38.85,26.47 | v73.39,0.81 76.42,0.81 RN5.1
  Top 0.406: D3.A 37.83,26.39 C43.1
  Bottom 0.254: v38.85,26.47 40.88,26.47 42.66,24.69 42.66,16.56 40.37,14.28 40.37,13.01 49.51,3.86 59.67,3.86 60.18,3.35 70.85,3.35 v73.39,0.81
RD+
  Top 0.254: RN2.4 95.16,9.77 94.48,10.46 IC4.29
RD-
  Top 0.254: IC4.30 93.95,10.96 95.16,12.17 RN2.1
RESET  (via drill 0.3)
  Top 0.254: IC3.30 60.24,11.16 61.45,9.96 62.21,9.96 62.47,9.7 63.23,9.7 68.56,4.37 70.6,4.37 72.63,2.34 73.39,2.34 v73.64,2.59 | v76.18,1.58 77.18,1.58 77.18,1.34 77.71,0.81 80.88,0.81 C47.2
  Bottom 0.254: v73.64,2.59 75.17,2.59 v76.18,1.58
RESET2  (via drill 0.3)
  Top 0.254: D4.A 93.8,7.76 IC4.24 91.42,7.23 v91.42,3.35 92.19,2.59 ICSP1.5 | v78.72,3.86 78.22,3.86 78.07,3.72 RN5.7
  Bottom 0.254: v91.42,3.35 91.42,3.86 v78.72,3.86
RXD0  (via drill 0.3)
  Top 0.254: IC3.2 50.59,20.63 61.45,20.63 62.72,19.36 66.02,19.36 v66.28,19.61 | v70.6,19.61 73.39,19.61 79.99,13.01 82.79,13.01 82.79,14.02 82.6,14.21 RN4.1 82.79,14.88 82.79,19.1 82.28,19.61 v82.28,22.15
  Bottom 0.254: v66.28,19.61 v70.6,19.61 | v82.28,22.15 86.11,25.98 RXD-TXD.2
RXL
  Top 0.203: IC4.10 85.09,11.46 RX.C
SCK  (via drill 0.3)
  Top 0.254: IC3.20 57.39,14.69 v57.39,15.29 | ICSP.3 78.22,31.8 98.31,31.8 arc90 U8.12
  Bottom 0.254: v57.39,15.29 69.07,26.98 71.61,26.98 73.78,29.14 ICSP.3
SCK2
  Top 0.254: IC4.15 86.11,8.96 85.33,8.18 85.33,1.83 86.34,0.81 89.39,0.81 90.15,1.58 ICSP1.3
SCL  (via drill 0.3)
  Top 0.254: IC3.43 64.9,15.78 65.64,15.04 66.53,15.04 | 67.24,15.04 67.17,15.04 66.53,15.04 | 66.53,15.04 v66.02,14.53
  Top 0.305: IC3.43 65.58,15.04 65.64,15.04 | 67.24,15.04 RN1.3
  Bottom 0.254: v66.02,14.53 66.53,15.04 72.89,15.04 SDA-SCL.2
SDA
  Top 0.254: 67.8,15.55 67.86,15.55 | IC3.44 65.78,15.55 67.8,15.55 | 67.8,15.55 70.21,17.95 SDA-SCL.1
  Top 0.305: RN1.2 67.86,15.55
SDCLK
  Top 0.254: U8.3 106.22,31.86 107.68,33.33 107.68,40.18 108.44,40.95 109.27,40.95 U2.5
SDCSH
  Top 0.254: U8.5 105.49,33.16 106.28,33.96 106.28,42.85 107.81,44.38 108.93,44.38 U2.2
SDDI
  Top 0.254: U8.4 105.85,32.51 107.05,33.71 107.05,41.96 108.31,43.23 U2.3
SDDO
  Top 0.254: U8.2 106.46,31.21 108.19,32.94 108.19,38.28 108.75,38.84 U2.7
TXD0  (via drill 0.3)
  Top 0.254: IC3.3 50.79,20.12 61.2,20.12 62.47,18.85 65.01,18.85 v65.26,18.59 | v77.83,21.77 76.69,20.63 v76.69,18.59 81.88,13.41 RN4.2
  Bottom 0.254: v65.26,18.59 67.29,16.56 72.63,16.56 74.66,18.59 v76.69,18.59 | v77.83,21.77 84.31,28.25 RXD-TXD.1
TXL
  Top 0.203: IC4.11 85.82,10.96 85.07,10.21 85.07,9.67 TX.C
USBVCC
  Top 0.254: IC4.31 92.93,11.46 93.46,11.99
  Top 0.61: 93.46,11.99 93.46,13.77 93.2,14.02 92.19,14.02 91.68,14.53 91.68,15.67 C44.1 91.81,18.72 92.44,19.36 F1.1
USHIELD
  Top 0.813: Z1.1 Z2.1 98.44,16.29 L2.2 104.81,16.39 X4.P$2
  Top 1.27: X4.P$2 108.19,15.2 108.19,7.77 X4.P$1
VAR
  Top 0.254: R8.W 41.58,7.09 LCD.10
VUCAP
  Top 0.254: IC4.27 92.17,9.46 93.2,8.43 93.96,8.43 95.74,6.66 96.63,6.66 C50.1
XT1
  Top 0.254: C51.1 88.5,19.74 Y2.2 | C51.1 R44.1 | IC4.1 90.89,14.56 90.66,14.78 88.88,14.78 88.63,15.04 88.63,15.67 C51.1
XT2
  Top 0.254: Y2.1 83.68,19.74 C52.1 R44.2 85.33,15.67 85.33,14.78 85.84,14.28 90.15,14.28 90.39,14.04 IC4.2
XTAL1
  Top 0.254: Y1.3 66.4,10.53 R43.1 64.11,12.37 63.48,11.74 62.52,11.74 IC3.34
XTAL2
  Top 0.254: IC3.33 62.45,11.11 R43.2 65.14,8.96 Y1.1
XVCC  (via drill 0.81)
  Top 0.813: F1.2 100.57,19.36 v101.08,18.85
  Bottom 0.813: v101.08,18.85 101.08,12.85 X4.1

## Text on the board
tPlace: X-M | Y-M | Z-M | E-M | 3D Printer | Motherboard | Baboi v1.1 | PWR | MICROSD | PWR | ICSP | TXD0 | FAN | X-STOP | RXD0 | GND | Y-STOP | Z-STOP_MIN | HotEnd | Z-STOP_MAX | SDA | SCL | GND | JOYSTICK | HeatBed | RESET | RX | ON | TX | HeatBed-T | HotEnd-T | L | LCD | 1
tNames: GND
tDocu: All in One 3D Printer Controller | Baboi V1.1 Beta | GPL | Pin Map of Baboi V1.1 Beta | Visit www.efuntime.com for more info | Reprap.org/wiki/baboi | Note: Reversing input power incorrectly will destory electronic | 1B 1A 2B 2A | 1B 1A 2B 2A | 1B 1A 2B 2A | 1B 1A 2B 2A | X-MOTOR | Y-MOTOR | Z-MOTOR | E-MOTOR | Parts | Pin # | X-MOTOR | DIR: D24, STEP: D23, !ENABLE: D22 | + | Y-MOTOR | DIR: D27, STEP: D26, !ENABLE: D25 | Z-MOTOR | DIR: D39, STEP: D29, !ENABLE: D28 | E-MOTOR | DIR: D32, STEP: D31, !ENABLE: D30 | - | PWN-FAN | D5 | HOTEND | D2 | + | HOTEND-T | A13 | HEATBED | D3 | HEATBED-T | A14 | - | X-STOP | D35 | 12V POWER SUPPLY | Y-STOP | D36 | Z-STOP_MIN | D37 | Z-STOP_MAX | D38 | LCD | D6, D7, D8, D9, D10, D11 | JOYSTICK | A3, A4, D16 | 5V | + | PWN-FAN | - | + | HOTEND | - | A3 | A4 | + | D16 | 5V | GND | RESET | - | HEATBED | GND | 5V | VAR | D6 | D7 | D8 | D9 | D10 | GND | D11 | 5V | GND | GND | 5V | VAR | D6 | GND | D7 | D8 | D9 | D10 | D11 | 5V | GND | 1 | 16 | 20X 4 LCD | Copyright @ 2013 - efuntime.com